# Altium schematic sheet Carte_alim.SchDoc
size A4
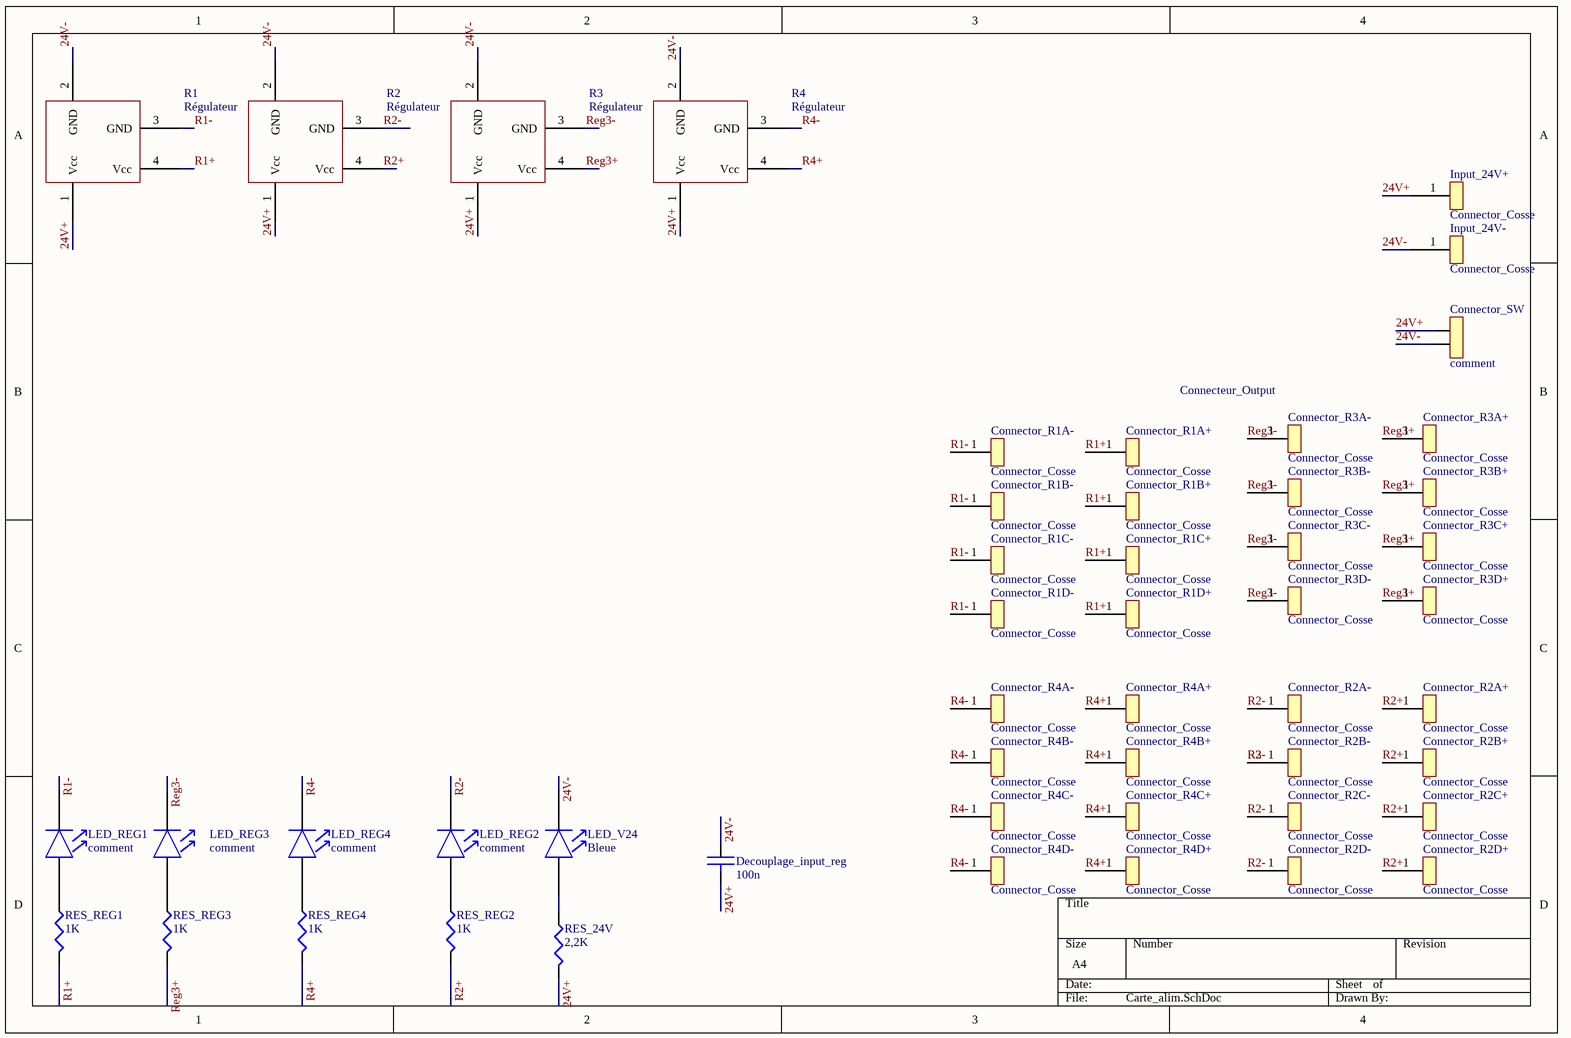
[diagram p0: Carte_alim.SchDoc]

## Parts
Connector_R1A+  Connector_Cosse  [Connector_Cosse]
Connector_R1A-  Connector_Cosse  [Connector_Cosse]
Connector_R1B+  Connector_Cosse  [Connector_Cosse]
Connector_R1B-  Connector_Cosse  [Connector_Cosse]
Connector_R1C+  Connector_Cosse  [Connector_Cosse]
Connector_R1C-  Connector_Cosse  [Connector_Cosse]
Connector_R1D+  Connector_Cosse  [Connector_Cosse]
Connector_R1D-  Connector_Cosse  [Connector_Cosse]
Connector_R2A+  Connector_Cosse  [Connector_Cosse]
Connector_R2A-  Connector_Cosse  [Connector_Cosse]
Connector_R2B+  Connector_Cosse  [Connector_Cosse]
Connector_R2B-  Connector_Cosse  [Connector_Cosse]
Connector_R2C+  Connector_Cosse  [Connector_Cosse]
Connector_R2C-  Connector_Cosse  [Connector_Cosse]
Connector_R2D+  Connector_Cosse  [Connector_Cosse]
Connector_R2D-  Connector_Cosse  [Connector_Cosse]
Connector_R3A+  Connector_Cosse  [Connector_Cosse]
Connector_R3A-  Connector_Cosse  [Connector_Cosse]
Connector_R3B+  Connector_Cosse  [Connector_Cosse]
Connector_R3B-  Connector_Cosse  [Connector_Cosse]
Connector_R3C+  Connector_Cosse  [Connector_Cosse]
Connector_R3C-  Connector_Cosse  [Connector_Cosse]
Connector_R3D+  Connector_Cosse  [Connector_Cosse]
Connector_R3D-  Connector_Cosse  [Connector_Cosse]
Connector_R4A+  Connector_Cosse  [Connector_Cosse]
Connector_R4A-  Connector_Cosse  [Connector_Cosse]
Connector_R4B+  Connector_Cosse  [Connector_Cosse]
Connector_R4B-  Connector_Cosse  [Connector_Cosse]
Connector_R4C+  Connector_Cosse  [Connector_Cosse]
Connector_R4C-  Connector_Cosse  [Connector_Cosse]
Connector_R4D+  Connector_Cosse  [Connector_Cosse]
Connector_R4D-  Connector_Cosse  [Connector_Cosse]
Connector_SW  comment  [AMP_2]
Decouplage_input_reg  value 100n  [0805]  (hidden comment: CAP)
Input_24V+  Connector_Cosse  [Connector_Cosse]
Input_24V-  Connector_Cosse  [Connector_Cosse]
LED_REG1  comment  [LED0805]
LED_REG2  comment  [LED0805]
LED_REG3  comment  [LED0805]
LED_REG4  comment  [LED0805]
LED_V24  Bleue  [LED0805]
R1  Régulateur  [Régulateur]
R2  Régulateur  [Régulateur]
R3  Régulateur  [Régulateur]
R4  Régulateur  [Régulateur]
RES_24V  value 2,2K  [0805]
RES_REG1  value 1K  [0805]  (hidden comment: RES)
RES_REG2  value 1K  [0805]  (hidden comment: RES)
RES_REG3  value 1K  [0805]  (hidden comment: RES)
RES_REG4  value 1K  [0805]  (hidden comment: RES)

## Nets
24V+: Connector_SW.2 Decouplage_input_reg.2 Input_24V+.1 R1.1(Vcc) R2.1(Vcc) R3.1(Vcc) R4.1(Vcc) RES_24V.2
24V-: Connector_SW.1 Decouplage_input_reg.1 Input_24V-.1 LED_V24.K R1.2(GND) R2.2(GND) R3.2(GND) R4.2(GND)
R1+: Connector_R1A+.1 Connector_R1B+.1 Connector_R1C+.1 Connector_R1D+.1 R1.4(Vcc) RES_REG1.2
R1-: Connector_R1A-.1 Connector_R1B-.1 Connector_R1C-.1 Connector_R1D-.1 LED_REG1.K R1.3(GND)
R2+: Connector_R2A+.1 Connector_R2B+.1 Connector_R2C+.1 Connector_R2D+.1 R2.4(Vcc) RES_REG2.2
R2-: Connector_R2A-.1 Connector_R2B-.1 Connector_R2C-.1 Connector_R2D-.1 LED_REG2.K R2.3(GND)  [also labelled R3-]
R4+: Connector_R4A+.1 Connector_R4B+.1 Connector_R4C+.1 Connector_R4D+.1 R4.4(Vcc) RES_REG4.2
R4-: Connector_R4A-.1 Connector_R4B-.1 Connector_R4C-.1 Connector_R4D-.1 LED_REG4.K R4.3(GND)
Reg3+: Connector_R3A+.1 Connector_R3B+.1 Connector_R3C+.1 Connector_R3D+.1 R3.4(Vcc) RES_REG3.2
Reg3-: Connector_R3A-.1 Connector_R3B-.1 Connector_R3C-.1 Connector_R3D-.1 LED_REG3.K R3.3(GND)
NetLED_REG1_A: LED_REG1.A RES_REG1.1
NetLED_REG2_A: LED_REG2.A RES_REG2.1
NetLED_REG3_A: LED_REG3.A RES_REG3.1
NetLED_REG4_A: LED_REG4.A RES_REG4.1
NetLED_V24_A: LED_V24.A RES_24V.1

## Notes on the sheet
- (near Connector_R3A-) Connecteur_Output

## Library data of the parts
Connector_SW = POWER2: connecteur alim 2 pôles
Decouplage_input_reg = CAP: capacité non polarisée
LED_REG1-LED_REG4 LED_V24 = LED: LED 5mm/3mm/CMS
R1-R4 = Régulateur: Régulateur de tension
RES_24V RES_REG1-RES_REG4 = RES: resistance